# Altium schematic sheet Fan.SchDoc
size A4; SheetNumber: 4; SheetTotal: 14
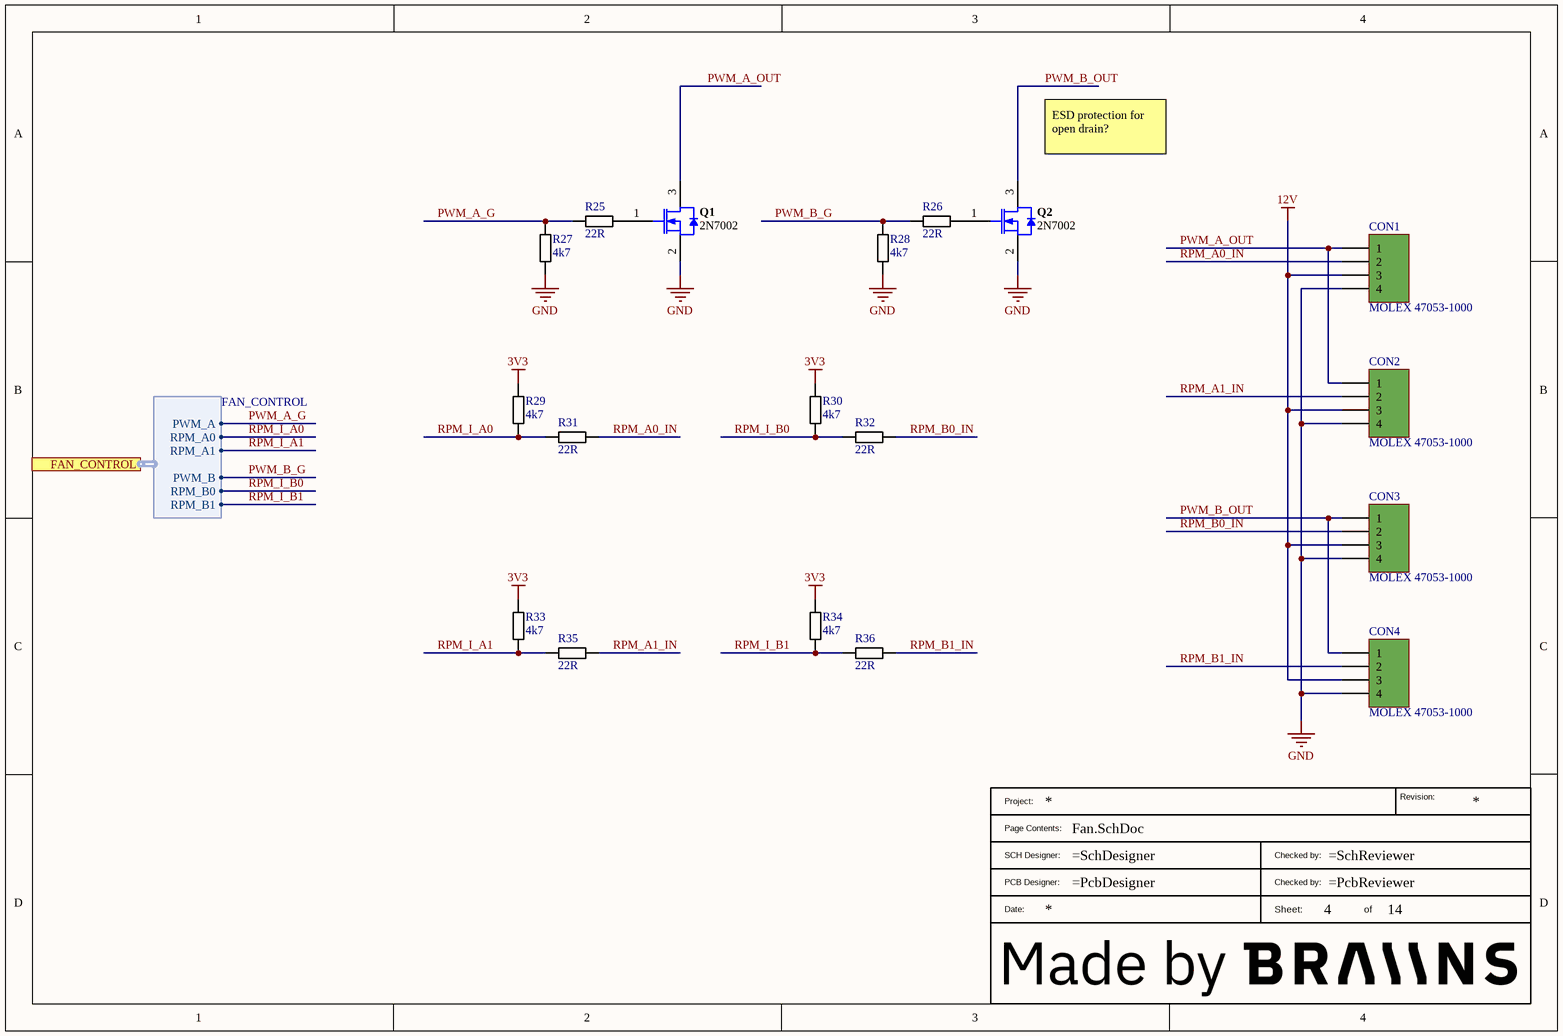
[diagram p0: Fan.SchDoc]

## Parts
?  BraiinsTitleBlockWithLogo  (value not drawn)  (graphical)
CON1  MOLEX 47053-1000  [MOLEX_47053-1000_BIGPADS]
CON2  MOLEX 47053-1000  [MOLEX_47053-1000_BIGPADS]
CON3  MOLEX 47053-1000  [MOLEX_47053-1000_BIGPADS]
CON4  MOLEX 47053-1000  [MOLEX_47053-1000_BIGPADS]
Q1  2N7002  [INF-PG-SOT23_M]
Q2  2N7002  [INF-PG-SOT23_M]
R25  22R  [RES0402]
R26  22R  [RES0402]
R27  4k7  [RES0402]
R28  4k7  [RES0402]
R29  4k7  [RES0402]
R30  4k7  [RES0402]
R31  22R  [RES0402]
R32  22R  [RES0402]
R33  4k7  [RES0402]
R34  4k7  [RES0402]
R35  22R  [RES0402]
R36  22R  [RES0402]

## Ports
FAN_CONTROL (harness FAN_CONTROL)

## Harnesses
FAN_CONTROL: PWM_A, PWM_B, RPM_A0, RPM_A1, RPM_B0, RPM_B1

## Nets
3V3: R29.1 R30.1 R33.1 R34.1
12V: CON1.3 CON2.3 CON3.3 CON4.3
GND: CON1.4 CON2.4 CON3.4 CON4.4 Q1.2(SOURCE) Q2.2(SOURCE) R27.2 R28.2
PWM_A_G: R25.1 R27.1 ; port FAN_CONTROL.PWM_A
PWM_A_OUT: CON1.1 CON2.1 Q1.3(DRAIN)
PWM_B_G: R26.1 R28.1 ; port FAN_CONTROL.PWM_B
PWM_B_OUT: CON3.1 CON4.1 Q2.3(DRAIN)
RPM_A0_IN: CON1.2 R31.2
RPM_A1_IN: CON2.2 R35.2
RPM_B0_IN: CON3.2 R32.2
RPM_B1_IN: CON4.2 R36.2
RPM_I_A0: R29.2 R31.1 ; port FAN_CONTROL.RPM_A0
RPM_I_A1: R33.2 R35.1 ; port FAN_CONTROL.RPM_A1
RPM_I_B0: R30.2 R32.1 ; port FAN_CONTROL.RPM_B0
RPM_I_B1: R34.2 R36.1 ; port FAN_CONTROL.RPM_B1
NetQ1_1: Q1.1(GATE) R25.2
NetQ2_1: Q2.1(GATE) R26.2

## Notes on the sheet
- ESD protection for open drain?
- (in symbol BraiinsTitleBlockWithLogo) Revision:; Project:; Page Contents:; SCH Designer:; Checked by:; PCB Designer:; Date:; Sheet:; of

## Library data of the parts
CON1-CON4 = 30102: MOLEX KK254 4pin with LOCK, MALE; Part_Type: Connector; Part_Status: New; ID: 30102; Updated By: janjuranek; Value: MOLEX 47053-1000; Manufacturer Part Number: MOLEX_47053-1000; Manufacturer: Molex; Manufacturer Part Description: MOLEX KK254 4pin with LOCK, MALE; RoHS: Yes; Created By: janjuranek; Created_Date: 2023-03-14 02:15:44; Updated_Date: 2023-07-13 14:58:10; ComponentLink1Description: Datasheet; ComponentLink2Description: Supplier Part Details
Q1 Q2 = CMP-1149-00026-1: N-Channel OptiMOS Small-Signal-Transistor, 60 V VDS, 0.3 A ID, -55 to 150 degC, PG-SOT23, Reel, Green; Manufacturer: Infineon; RDS (on) (max) (@4.5V): 4,000 mOhm; VDS (max): 60 V; IDpuls (max): 1.2Â A; QG: 0.4Â nC; RDS (on) (max): 3,000 mOhm; RthJA (max): 250 K/W; ID (max): 0.3Â A; VGS(th) (max): 2.5Â V; VGS(th) (min): 1.5Â V; Green: TRUE; Ptot (max): 0.5Â W; PackageDescription: 3-Pin Small Outline Transistor Package, 2.9 x 1.3 mm Body, 0.95 mm Pitch; Halogen-free: TRUE; ComponentLink2Description: Datasheet; ComponentLink1URL: http://www.infineon.com/; Packing: Reel; DatasheetVersion: Rev. 2.4; PartNumber: 2N7002; PackageReference: PG-SOT23; PackageVersion: Apr-08; ComponentLink3URL: http://www.infineon.com/dgdl/SOT23-Package_Overview.pdf?folderId=db3a30431936bc4b0119532290053c66&fileId=db3a30431936bc4b0119533468123c85; ComponentLink1Description: Manufacturer URL; Mounting Technology: Surface Mount; ComponentLink3Description: Package Specification; ComponentLink2URL: http://www.infineon.com/dgdl/2N7002_Rev2.4.pdf?folderId=db3a3043156fd573011622e10b5c1f67&fileId=db3a304319bc939a0119c2a9461e79e6
R25 R26 R31 R32 R35 R36 = 30156: RES 22R Ohm 1% 0402; Part_Status: New; ID: 30156; Updated By: janjuranek; Sorted_Value: 22; Value: 22R; Part_Type: Resistor; Manufacturer Part Description: RES 22R Ohm 1% 0402; Package_Case: 0402; RoHS: Yes; Tolerance: 1%; Created By: janjuranek; Created_Date: 2023-05-01 19:29:39; Updated_Date: 2023-05-01 19:30:05; ComponentLink1Description: Datasheet; ComponentLink2Description: Supplier Part Details
R27-R30 R33 R34 = 30073: RES 4k7 Ohm 1% 0402; Part_Status: New; ID: 30073; Updated By: Jan; Sorted_Value: 4; Value: 4k7; Part_Type: Resistor; Manufacturer Part Description: RES 4k7 Ohm 1% 0402; Package_Case: 0402; RoHS: Yes; Tolerance: 1%; Created By: Jan; Created_Date: 2023-03-02 13:15:12; Updated_Date: 2023-03-02 13:15:46; ComponentLink1Description: Datasheet; ComponentLink2Description: Supplier Part Details; Temperature Range: -40 to +150C